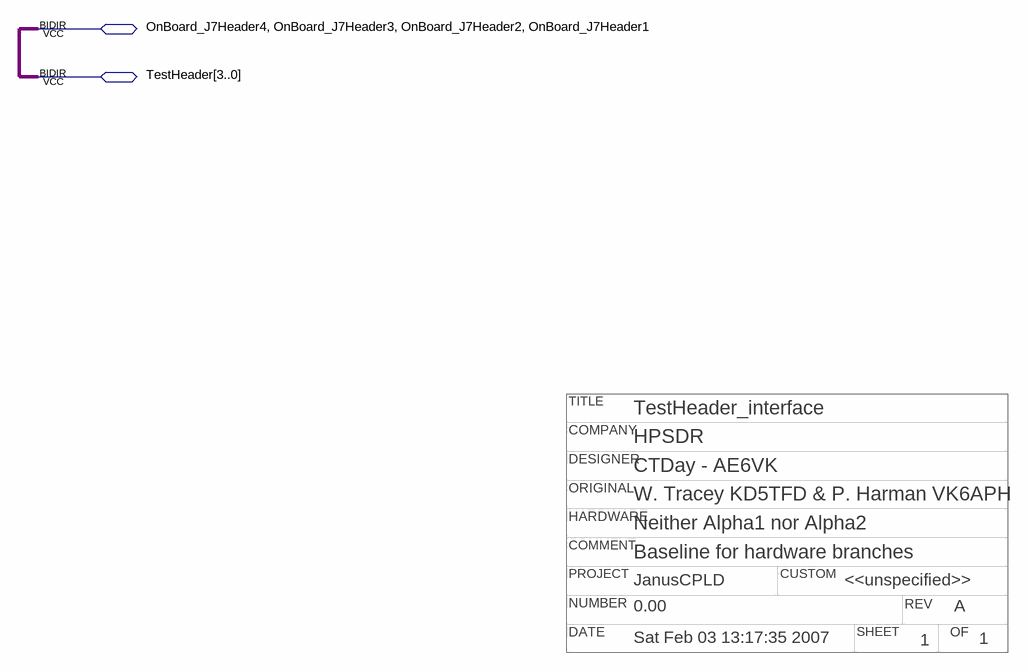
[diagram p0: schematic sheet]
// Quartus schematic TestHeader_interface.bdf as structural Verilog: 0 symbols, 2 pins
// Title block: TITLE: TestHeader_interface; COMPANY: HPSDR; DESIGNER: CTDay - AE6VK; NUMBER: 0.00; REV: A; DATE: Sat Feb 03 13:17:35 2007; SHEET: 1; OF: 1; ORIGINAL: W. Tracey KD5TFD & P. Harman VK6APH; HARDWARE: Neither Alpha1 nor Alpha2; COMMENT: Baseline for hardware branches; PROJECT: JanusCPLD; CUSTOM: <<unspecified>>
module TestHeader_interface (
  inout  OnBoard_J7Header4,
  inout  OnBoard_J7Header3,
  inout  OnBoard_J7Header2,
  inout  OnBoard_J7Header1,
  inout  [3:0] TestHeader
);


  assign TestHeader = {OnBoard_J7Header4, OnBoard_J7Header3, OnBoard_J7Header2, OnBoard_J7Header1};
endmodule
